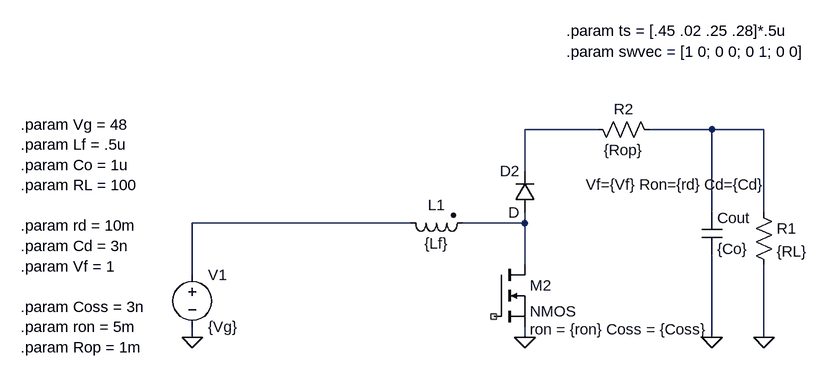
[diagram p0: schematic Boost_Async.asc]
Boost_Async.asc, the LTspice schematic file:
Version 4
SHEET 1 1524 680
WIRE 400 16 288 16
WIRE 576 16 480 16
WIRE 656 16 576 16
WIRE 288 80 288 16
WIRE 576 144 576 16
WIRE 656 144 656 16
WIRE 112 160 -224 160
WIRE 288 160 288 144
WIRE 288 160 192 160
WIRE 288 224 288 160
WIRE -224 240 -224 160
WIRE -224 336 -224 320
WIRE 288 336 288 320
WIRE 576 336 576 208
WIRE 656 336 656 224
FLAG 288 336 0
FLAG -224 336 0
FLAG 576 336 0
FLAG 656 336 0
SYMBOL nmos 240 224 R0
WINDOW 123 56 100 Left 2
SYMATTR Value2 ron = {ron} Coss = {Coss}
SYMATTR InstName M2
SYMBOL voltage -224 224 R0
WINDOW 123 0 0 Left 0
WINDOW 39 0 0 Left 0
SYMATTR InstName V1
SYMATTR Value {Vg}
SYMBOL ind2 96 144 M90
WINDOW 0 4 56 VBottom 2
WINDOW 3 32 56 VTop 2
SYMATTR InstName L1
SYMATTR Value {Lf}
SYMATTR Type ind
SYMBOL cap 560 144 R0
SYMATTR InstName Cout
SYMATTR Value {Co}
SYMBOL res 640 128 R0
SYMATTR InstName R1
SYMATTR Value {RL}
SYMBOL diode 304 144 R180
WINDOW 0 24 64 Left 2
WINDOW 3 24 0 Left 2
WINDOW 123 -356 43 Left 2
SYMATTR InstName D2
SYMATTR Value2 Vf={Vf} Ron={rd} Cd={Cd}
SYMBOL res 384 0 M90
WINDOW 0 0 56 VBottom 2
WINDOW 3 32 56 VTop 2
SYMATTR InstName R2
SYMATTR Value {Rop}
TEXT 352 -136 Left 2 !.param ts = [.45 .02 .25 .28]*.5u
TEXT 352 -104 Left 2 !.param swvec = [1 0; 0 0; 0 1; 0 0]
TEXT -488 8 Left 2 !.param Vg = 48\n.param Lf = .5u\n.param Co = 1u\n.param RL = 100\n \n.param rd = 10m\n.param Cd = 3n\n.param Vf = 1\n \n.param Coss = 3n\n.param ron = 5m\n.param Rop = 1m

The netlist it stands for:
* Boost_Async.asc
M2 N004 NC_01 0 0 NMOS ron = {ron} Coss = {Coss}
V1 N003 0 {Vg}
L1 N003 N004 {Lf}
Cout N002 0 {Co}
R1 N002 0 {RL}
D2 N004 N001 D Vf={Vf} Ron={rd} Cd={Cd}
R2 N001 N002 {Rop}
.model D D
.lib standard.dio
.model NMOS NMOS
.model PMOS PMOS
.lib standard.mos
.param ts = [.45 .02 .25 .28]*.5u
.param swvec = [1 0; 0 0; 0 1; 0 0]
.param Vg = 48
.param Lf = .5u
.param Co = 1u
.param RL = 100
.param rd = 10m
.param Cd = 3n
.param Vf = 1
.param Coss = 3n
.param ron = 5m
.param Rop = 1m
.backanno
.end